# Altium schematic sheet OUTPUT.SchDoc
size A4
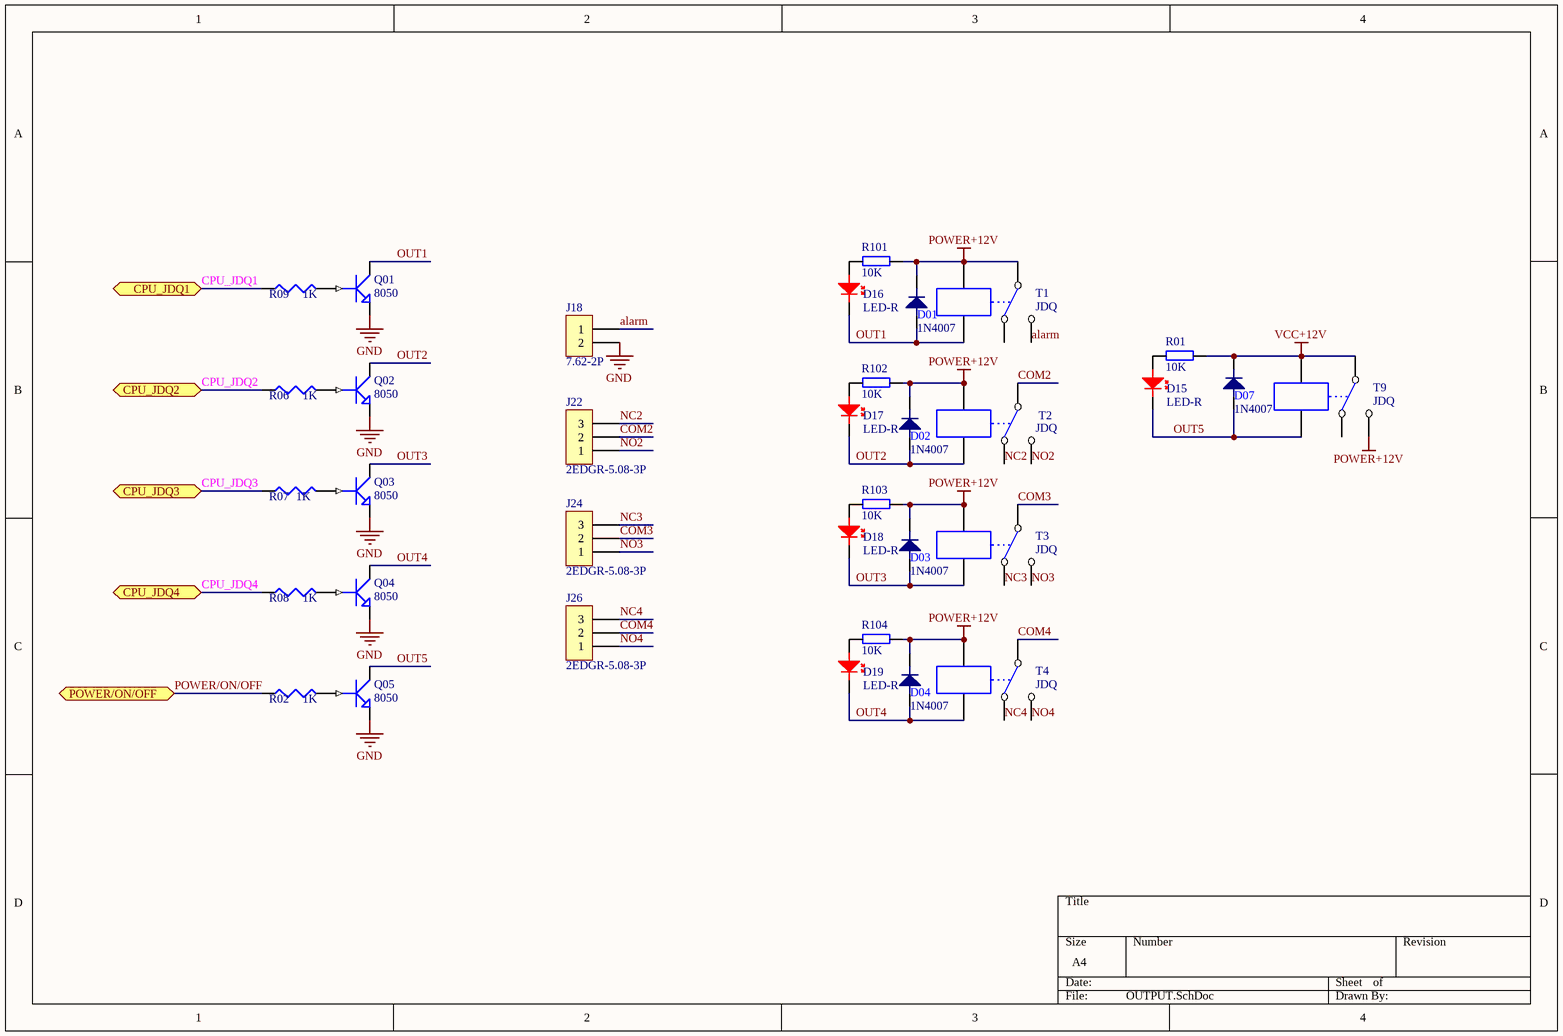
[diagram p0: OUTPUT.SchDoc]

## Parts
D01  1N4007  [DO-214AC(SMA)]
D02  1N4007  [DO-214AC(SMA)]
D03  1N4007  [DO-214AC(SMA)]
D04  1N4007  [DO-214AC(SMA)]
D07  1N4007  [DO-214AC(SMA)]
D15  LED-R  [LED-0603]
D16  LED-R  [LED-0603]
D17  LED-R  [LED-0603]
D18  LED-R  [LED-0603]
D19  LED-R  [LED-0603]
J18  7.62-2P  [5.08-2P]
J22  2EDGR-5.08-3P  [5.08-3P]
J24  2EDGR-5.08-3P  [5.08-3P]
J26  2EDGR-5.08-3P  [5.08-3P]
Q01  8050  [SOT-23]
Q02  8050  [SOT-23]
Q03  8050  [SOT-23]
Q04  8050  [SOT-23]
Q05  8050  [SOT-23]
R01  10K  [0603]
R02  1K  [0603]
R06  1K  [0603]
R07  1K  [0603]
R08  1K  [0603]
R09  1K  [0603]
R101  10K  [0603]
R102  10K  [0603]
R103  10K  [0603]
R104  10K  [0603]
T1  JDQ  [JDQ]
T2  JDQ  [JDQ]
T3  JDQ  [JDQ]
T4  JDQ  [JDQ]
T9  JDQ  [JDQ]

## Ports
CPU_JDQ1, CPU_JDQ2, CPU_JDQ3, CPU_JDQ4, POWER/ON/OFF

## Nets
GND: J18.2 Q01.2(E) Q02.2(E) Q03.2(E) Q04.2(E) Q05.2(E)
POWER+12V: D01.2 D02.2 D03.2 D04.2 R101.1 R102.1 R103.1 R104.1 T1.1 T1.4 T2.4 T3.4 T4.4 T9.2
VCC+12V: D07.2 R01.1 T9.1 T9.4
alarm: J18.1 T1.2
COM2: J22.2 T2.1
COM3: J24.2 T3.1
COM4: J26.2 T4.1
CPU_JDQ1: R09.1 ; port CPU_JDQ1
CPU_JDQ2: R06.1 ; port CPU_JDQ2
CPU_JDQ3: R07.1 ; port CPU_JDQ3
CPU_JDQ4: R08.1 ; port CPU_JDQ4
NC2: J22.3 T2.3
NC3: J24.3 T3.3
NC4: J26.3 T4.3
NO2: J22.1 T2.2
NO3: J24.1 T3.2
NO4: J26.1 T4.2
OUT1: D01.1 D16.2 Q01.3(C) T1.5
OUT2: D02.1 D17.2 Q02.3(C) T2.5
OUT3: D03.1 D18.2 Q03.3(C) T3.5
OUT4: D04.1 D19.2 Q04.3(C) T4.5
OUT5: D07.1 D15.2 Q05.3(C) T9.5
POWER/ON/OFF: R02.1 ; port POWER/ON/OFF
NetD15_1: D15.1 R01.2
NetD16_1: D16.1 R101.2
NetD17_1: D17.1 R102.2
NetD18_1: D18.1 R103.2
NetD19_1: D19.1 R104.2
NetQ01_1: Q01.1(B) R09.2
NetQ02_1: Q02.1(B) R06.2
NetQ03_1: Q03.1(B) R07.2
NetQ04_1: Q04.1(B) R08.2
NetQ05_1: Q05.1(B) R02.2

Not connected (* = marked no-connect by the designer): T1 3; T9 3

## Library data of the parts
D01 D02 D03 D04 D07 = 1N4007: 1A整流二极管
D15 = LED-RED: 红色LED
D16-D19 = LED-RED: 绿色LED
J18 = SIP2A-2.50（带槽）
J22 J24 J26 = SIP3A-2.50（带槽）
Q01 Q02 Q03 Q04 Q05 = NPN1
R01 R101-R104 = Res
R02 R06 R07 R08 R09 = RES1